# EAGLE schematic arduinoXbeere (EAGLE 5.11)
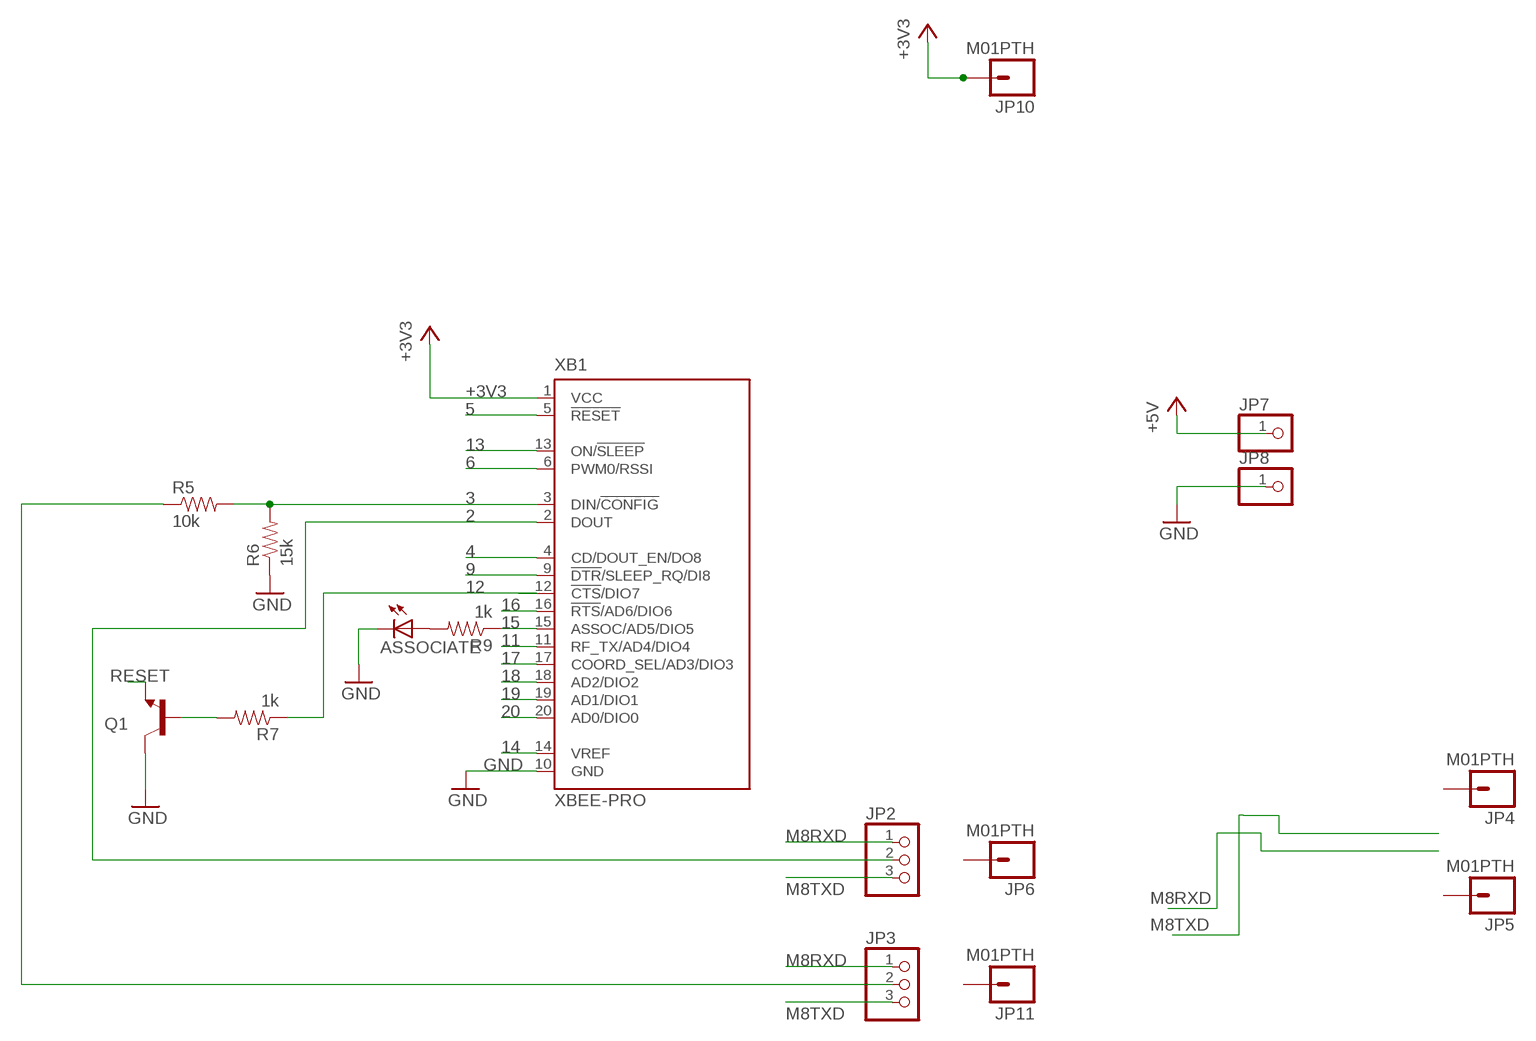
[diagram p0: schematic, sheet 1]

## Parts
ASSOCIATE  LED-FKIT-1206  [FKIT-LED-1206]
JP2  PINHD-1X3  [1X03]
JP3  PINHD-1X3  [1X03]
JP4  M01PTH  [1X01]
JP5  M01PTH  [1X01]
JP6  M01PTH  [1X01]
JP7  PINHD-1X1  [1X01]
JP8  PINHD-1X1  [1X01]
JP10  M01PTH  [1X01]
JP11  M01PTH  [1X01]
Q1  TRANSISTOR_NPNSOT23-3  [SOT23-3]
R5  10k  RESISTOR0402-RES  [0402-RES]
R6  15k  RESISTOR0402-RES  [0402-RES]
R7  1k  RESISTOR0402-RES  [0402-RES]
R9  1k  RESISTOR0402-RES  [0402-RES]
XB1  XBEE-PRO  [XBEE-PRO]

## Nets
2: JP2.2 XB1.2(DOUT)
3: R5.2 R6.2 XB1.3(DIN/!CONFIG)
4: XB1.4(CD/DOUT_EN/DO8)
5: XB1.5(!RESET)
6: XB1.6(PWM0/RSSI)
9: XB1.9(!DTR!/SLEEP_RQ/DI8)
11: XB1.11(RF_TX/AD4/DIO4)
12: R7.1 XB1.12(!CTS!/DIO7)
13: XB1.13(ON/!SLEEP)
14: XB1.14(VREF)
15: R9.1 XB1.15(ASSOC/AD5/DIO5)
16: XB1.16(!RTS!/AD6/DIO6)
17: XB1.17(COORD_SEL/AD3/DIO3)
18: XB1.18(AD2/DIO2)
19: XB1.19(AD1/DIO1)
20: XB1.20(AD0/DIO0)
+3V3: JP10.1 XB1.1(VCC)
+5V [power]: JP7.1
GND [power]: ASSOCIATE.C JP8.1 Q1.3(C) R6.1 XB1.10(GND)
M8RXD: JP2.1 JP3.1
M8TXD: JP2.3 JP3.3
N$1: ASSOCIATE.A R9.2
N$5: JP3.2 R5.1
N$6: Q1.1(B) R7.2
RESET: Q1.2(E)
Unconnected: JP4.1 JP5.1 JP6.1 JP11.1

## Library data of the parts
ASSOCIATE = SparkFun:LED: LEDs Standard schematic elements and footprints for 5mm, 3mm, 1206, and 0603 sized LEDs. 5mm - Spark Fun Electronics SKU : COM-00529 (and others)
JP2 JP3 = pinhead:PINHD-1X3: PIN HEADER
JP4-JP6 JP10 JP11 = SparkFun:M01: Header 1 Standard 1-pin 0.1" header. Use with straight break away headers (SKU : PRT-00116), right angle break away headers (PRT-00553), swiss pins (PRT-00743), machine pins (PRT-00117), and female headers (PRT-00115).
JP7 JP8 = pinhead:PINHD-1X1: PIN HEADER
Q1 = SparkFun:TRANSISTOR_NPN: Transistor NPN BJT configuration in SOT23 package. MMBT2222 is the common NPN we use. Double check BCE configuration again layout.
R5-R7 R9 = SparkFun:RESISTOR: Resistor Basic schematic elements and footprints for 0603, 1206, and PTH resistors.
XB1 = maxstream:XBEE: XBee (TM) /XBee-PRO(TM) OEM RF Modules Source: MaxStream, Inc. xbee_productmanual.pdf

## Net classes
1 power: width 0.61 mm